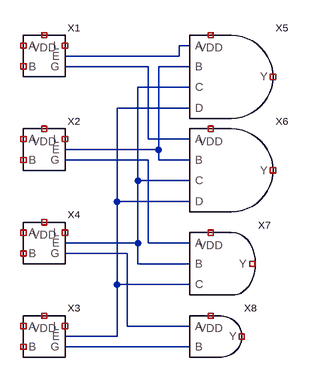
[diagram p0: schematic full-comparator-parallel.asc]
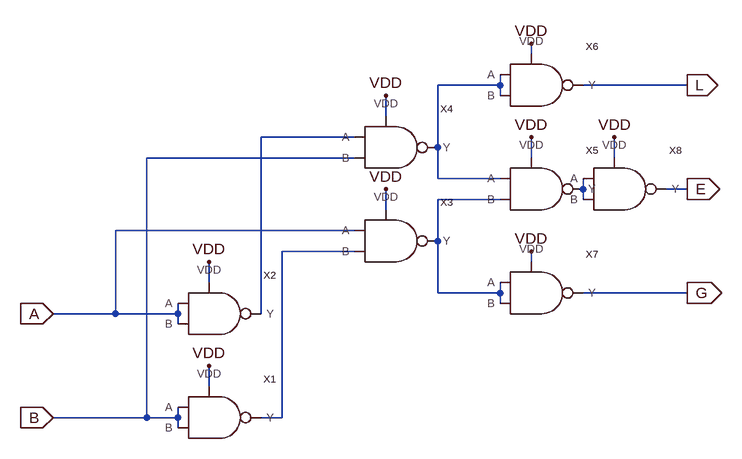
[diagram p1: sub-circuit full-comparator1.asc]
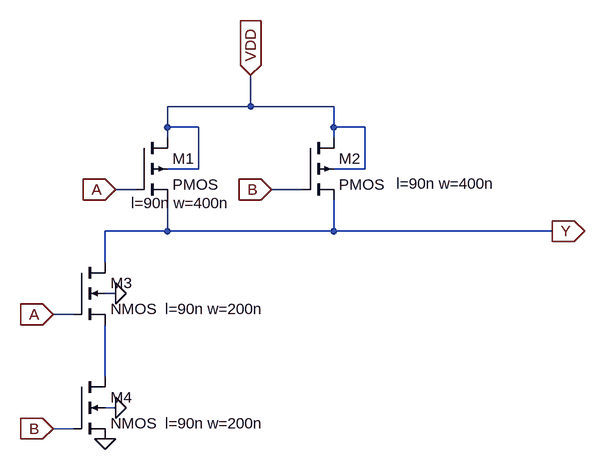
[diagram p2: sub-circuit nand.asc]
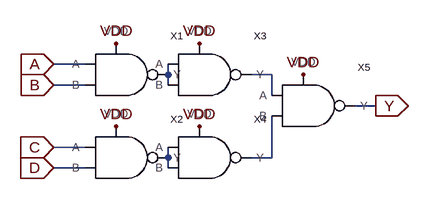
[diagram p3: sub-circuit and4.asc]
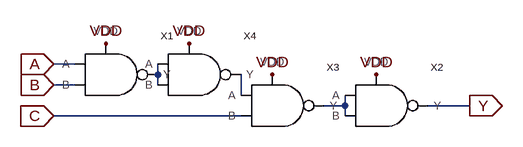
[diagram p4: sub-circuit and3.asc]
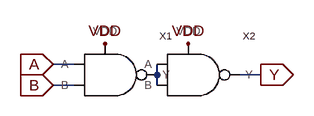
[diagram p5: sub-circuit and.asc]
full-comparator-parallel.asc, the LTspice schematic file:
Version 4
SHEET 1 880 680
WIRE 384 80 368 80
WIRE 368 96 368 80
WIRE 368 96 192 96
WIRE 320 112 192 112
WIRE 384 112 336 112
WIRE 384 144 304 144
WIRE 384 176 272 176
WIRE 320 224 320 112
WIRE 384 224 320 224
WIRE 336 240 336 112
WIRE 336 240 192 240
WIRE 320 256 192 256
WIRE 336 256 336 240
WIRE 384 256 336 256
WIRE 304 288 304 144
WIRE 384 288 304 288
WIRE 272 320 272 176
WIRE 384 320 272 320
WIRE 304 384 304 288
WIRE 304 384 192 384
WIRE 320 384 320 256
WIRE 384 384 320 384
WIRE 288 400 192 400
WIRE 304 416 304 384
WIRE 384 416 304 416
WIRE 272 448 272 320
WIRE 384 448 272 448
WIRE 288 512 288 400
WIRE 384 512 288 512
WIRE 272 528 272 448
WIRE 272 528 192 528
WIRE 384 544 192 544
SYMBOL full-comparator1 160 96 R0
SYMATTR InstName X1
SYMBOL full-comparator1 160 240 R0
SYMATTR InstName X2
SYMBOL full-comparator1 160 528 R0
SYMATTR InstName X3
SYMBOL full-comparator1 160 384 R0
SYMATTR InstName X4
SYMBOL and4 416 128 R0
SYMATTR InstName X5
SYMBOL and4 416 272 R0
SYMATTR InstName X6
SYMBOL and3 416 416 R0
SYMATTR InstName X7
SYMBOL and 416 528 R0
SYMATTR InstName X8

full-comparator1.asc, the sub-circuit schematic file:
Version 4
SHEET 1 880 680
WIRE 240 -320 240 -336
WIRE 192 -272 192 -288
WIRE 192 -272 96 -272
WIRE 480 -272 320 -272
WIRE 192 -256 192 -272
WIRE 16 -224 16 -256
WIRE -32 -192 -176 -192
WIRE 96 -176 96 -272
WIRE -32 -160 -352 -160
WIRE 240 -160 240 -192
WIRE 368 -160 368 -192
WIRE 96 -128 96 -176
WIRE 192 -128 96 -128
WIRE 320 -112 320 -128
WIRE 480 -112 448 -112
WIRE 192 -96 96 -96
WIRE 320 -96 320 -112
WIRE 16 -80 16 -112
WIRE -32 -48 -400 -48
WIRE 96 -32 96 -96
WIRE -32 -16 -144 -16
WIRE 240 0 240 -16
WIRE -256 32 -256 0
WIRE 96 48 96 -32
WIRE 192 48 192 32
WIRE 192 48 96 48
WIRE 480 48 320 48
WIRE 192 64 192 48
WIRE -400 80 -400 -48
WIRE -400 80 -496 80
WIRE -304 80 -304 64
WIRE -304 80 -400 80
WIRE -176 80 -176 -192
WIRE -304 96 -304 80
WIRE -256 192 -256 160
WIRE -352 240 -352 -160
WIRE -352 240 -496 240
WIRE -304 240 -304 224
WIRE -304 240 -352 240
WIRE -144 240 -144 -16
WIRE -144 240 -176 240
WIRE -304 256 -304 240
FLAG -496 240 B
IOPIN -496 240 In
FLAG -496 80 A
IOPIN -496 80 In
FLAG 480 -112 E
IOPIN 480 -112 Out
FLAG -256 160 VDD
FLAG -256 0 VDD
FLAG 16 -256 VDD
FLAG 16 -112 VDD
FLAG 240 -192 VDD
FLAG 480 48 G
IOPIN 480 48 Out
FLAG 480 -272 L
IOPIN 480 -272 Out
FLAG 240 -16 VDD
FLAG 240 -336 VDD
FLAG 368 -192 VDD
SYMBOL nand -256 240 R0
SYMATTR InstName X1
SYMBOL nand -256 80 R0
SYMATTR InstName X2
SYMBOL nand 16 -32 R0
SYMATTR InstName X3
SYMBOL nand 16 -176 R0
SYMATTR InstName X4
SYMBOL nand 240 -112 R0
SYMATTR InstName X5
SYMBOL nand 240 -272 R0
SYMATTR InstName X6
SYMBOL nand 240 48 R0
SYMATTR InstName X7
SYMBOL nand 368 -112 R0
SYMATTR InstName X8

nand.asc, the sub-circuit schematic file:
Version 4
SHEET 1 1436 680
WIRE 896 -896 896 -944
WIRE 896 -896 768 -896
WIRE 1024 -896 896 -896
WIRE 768 -864 768 -896
WIRE 816 -864 768 -864
WIRE 1024 -864 1024 -896
WIRE 1072 -864 1024 -864
WIRE 768 -848 768 -864
WIRE 1024 -848 1024 -864
WIRE 816 -800 816 -864
WIRE 816 -800 768 -800
WIRE 1072 -800 1072 -864
WIRE 1072 -800 1024 -800
WIRE 720 -768 688 -768
WIRE 976 -768 928 -768
WIRE 768 -704 768 -752
WIRE 768 -704 672 -704
WIRE 1024 -704 1024 -752
WIRE 1024 -704 768 -704
WIRE 1360 -704 1024 -704
WIRE 672 -656 672 -704
WIRE 688 -608 672 -608
WIRE 624 -576 592 -576
WIRE 672 -480 672 -560
WIRE 688 -432 672 -432
WIRE 624 -400 592 -400
FLAG 688 -768 A
IOPIN 688 -768 In
FLAG 592 -576 A
IOPIN 592 -576 In
FLAG 1360 -704 Y
IOPIN 1360 -704 Out
FLAG 896 -944 VDD
IOPIN 896 -944 In
FLAG 928 -768 B
IOPIN 928 -768 In
FLAG 592 -400 B
IOPIN 592 -400 In
FLAG 688 -608 0
FLAG 688 -432 0
FLAG 672 -384 0
SYMBOL pmos4 720 -848 R0
WINDOW 123 -8 101 Left 2
SYMATTR InstName M1
SYMATTR Value2 l=90n w=400n
SYMBOL pmos4 976 -848 R0
WINDOW 123 144 71 Left 2
SYMATTR InstName M2
SYMATTR Value2 l=90n w=400n
SYMBOL nmos4 624 -656 R0
WINDOW 123 140 72 Left 2
SYMATTR InstName M3
SYMATTR Value2 l=90n w=200n
SYMBOL nmos4 624 -480 R0
WINDOW 123 140 72 Left 2
SYMATTR InstName M4
SYMATTR Value2 l=90n w=200n

and4.asc, the sub-circuit schematic file:
Version 4
SHEET 1 880 680
WIRE 48 80 0 80
WIRE 176 96 176 80
WIRE 336 96 304 96
WIRE 48 112 0 112
WIRE 176 112 176 96
WIRE 336 128 336 96
WIRE 496 144 464 144
WIRE 48 208 0 208
WIRE 176 224 176 208
WIRE 336 224 336 160
WIRE 336 224 304 224
WIRE 48 240 0 240
WIRE 176 240 176 224
FLAG 0 80 A
IOPIN 0 80 In
FLAG 0 112 B
IOPIN 0 112 In
FLAG 0 208 C
IOPIN 0 208 In
FLAG 0 240 D
IOPIN 0 240 In
FLAG 496 144 Y
IOPIN 496 144 Out
FLAG 384 96 VDD
FLAG 224 48 VDD
FLAG 224 176 VDD
FLAG 96 48 VDD
FLAG 96 176 VDD
SYMBOL nand 96 96 R0
SYMATTR InstName X1
SYMBOL nand 96 224 R0
SYMATTR InstName X2
SYMBOL nand 224 96 R0
SYMATTR InstName X3
SYMBOL nand 224 224 R0
SYMATTR InstName X4
SYMBOL nand 384 144 R0
SYMATTR InstName X5

and3.asc, the sub-circuit schematic file:
Version 4
SHEET 1 880 680
WIRE 144 144 112 144
WIRE 272 160 272 144
WIRE 144 176 112 176
WIRE 272 176 272 160
WIRE 400 192 400 160
WIRE 560 208 560 192
WIRE 560 208 528 208
WIRE 752 208 688 208
WIRE 400 224 112 224
WIRE 560 224 560 208
FLAG 112 144 A
IOPIN 112 144 In
FLAG 192 112 VDD
FLAG 448 160 VDD
FLAG 320 112 VDD
FLAG 112 176 B
IOPIN 112 176 In
FLAG 112 224 C
IOPIN 112 224 In
FLAG 608 160 VDD
FLAG 752 208 Y
IOPIN 752 208 Out
SYMBOL nand 192 160 R0
SYMATTR InstName X1
SYMBOL nand 448 208 R0
SYMATTR InstName X3
SYMBOL nand 320 160 R0
SYMATTR InstName X4
SYMBOL nand 608 208 R0
SYMATTR InstName X2

and.asc, the sub-circuit schematic file:
Version 4
SHEET 1 880 680
WIRE 112 128 80 128
WIRE 240 144 240 128
WIRE 400 144 368 144
WIRE 112 160 80 160
WIRE 240 160 240 144
FLAG 80 128 A
IOPIN 80 128 In
FLAG 80 160 B
IOPIN 80 160 In
FLAG 400 144 Y
IOPIN 400 144 Out
FLAG 160 96 VDD
FLAG 288 96 VDD
SYMBOL nand 160 144 R0
SYMATTR InstName X1
SYMBOL nand 288 144 R0
SYMATTR InstName X2

The netlist it stands for:
* full-comparator-parallel.asc
XX1 NC_01 NC_02 NC_03 NC_04 N001 N002 full-comparator1
XX2 NC_05 NC_06 NC_07 NC_08 N003 N006 full-comparator1
XX3 NC_09 NC_10 NC_11 NC_12 N005 N008 full-comparator1
XX4 NC_13 NC_14 NC_15 NC_16 N004 N007 full-comparator1
XX5 N001 N003 N004 N005 NC_17 NC_18 and4
XX6 N002 N003 N004 N005 NC_19 NC_20 and4
XX7 N006 N004 N005 NC_21 NC_22 and3
XX8 N007 N008 NC_23 NC_24 and

* block symbol definitions
.subckt full-comparator1 A B VDD L E G
XX1 B B VDD N005 nand
XX2 A A VDD N002 nand
XX3 A N005 VDD N004 nand
XX4 N002 B VDD N001 nand
XX5 N001 N004 VDD N003 nand
XX6 N001 N001 VDD L nand
XX7 N004 N004 VDD G nand
XX8 N003 N003 VDD E nand
.ends full-comparator1

.subckt nand A B VDD Y
M1 VDD A Y VDD PMOS l=90n w=400n
M2 VDD B Y VDD PMOS l=90n w=400n
M3 Y A N001 0 NMOS l=90n w=200n
M4 N001 B 0 0 NMOS l=90n w=200n
.ends nand

.subckt and4 A B C D VDD Y
XX1 A B VDD N001 nand
XX2 C D VDD N003 nand
XX3 N001 N001 VDD N002 nand
XX4 N003 N003 VDD N004 nand
XX5 N002 N004 VDD Y nand
.ends and4

.subckt and3 A B C VDD Y
XX1 A B VDD N001 nand
XX3 N002 C VDD N003 nand
XX4 N001 N001 VDD N002 nand
XX2 N003 N003 VDD Y nand
.ends and3

.subckt and A B VDD Y
XX1 A B VDD N001 nand
XX2 N001 N001 VDD Y nand
.ends and

.model NMOS NMOS
.model PMOS PMOS
.lib standard.mos
.backanno
.end